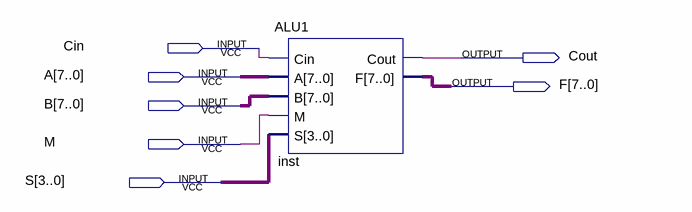
[diagram p0: schematic sheet]
// Quartus schematic ALU3.bdf as structural Verilog: 1 symbols, 7 pins
module ALU3 (
  input  Cin,
  input  [7:0] A,
  input  [7:0] B,
  input  M,
  input  [3:0] S,
  output Cout,
  output [7:0] F
);

  ALU1 inst (.Cin(Cin), .A(A), .B(B), .M(M), .S(S), .Cout(Cout), .F(F));
endmodule
